# Altium schematic sheet MiniClock.SchDoc
size A4; PageSetup: Record=PageOptions|CenterHorizontal=True|CenterVertical=True|PrintScale=1.05|XCorrection=1.00|YCorrection=1.00|PrintKind=1|BorderSize=5000000|LeftOffset=0|BottomOffset=0|Orientation=2|PaperLength=1000|PaperWidth=1000|Scale=100|PaperSource=7|PrintQuality=-3|MediaType=1|DitherType=10|PrintScaleMode=1|PaperKind=A4|PaperIndex=9
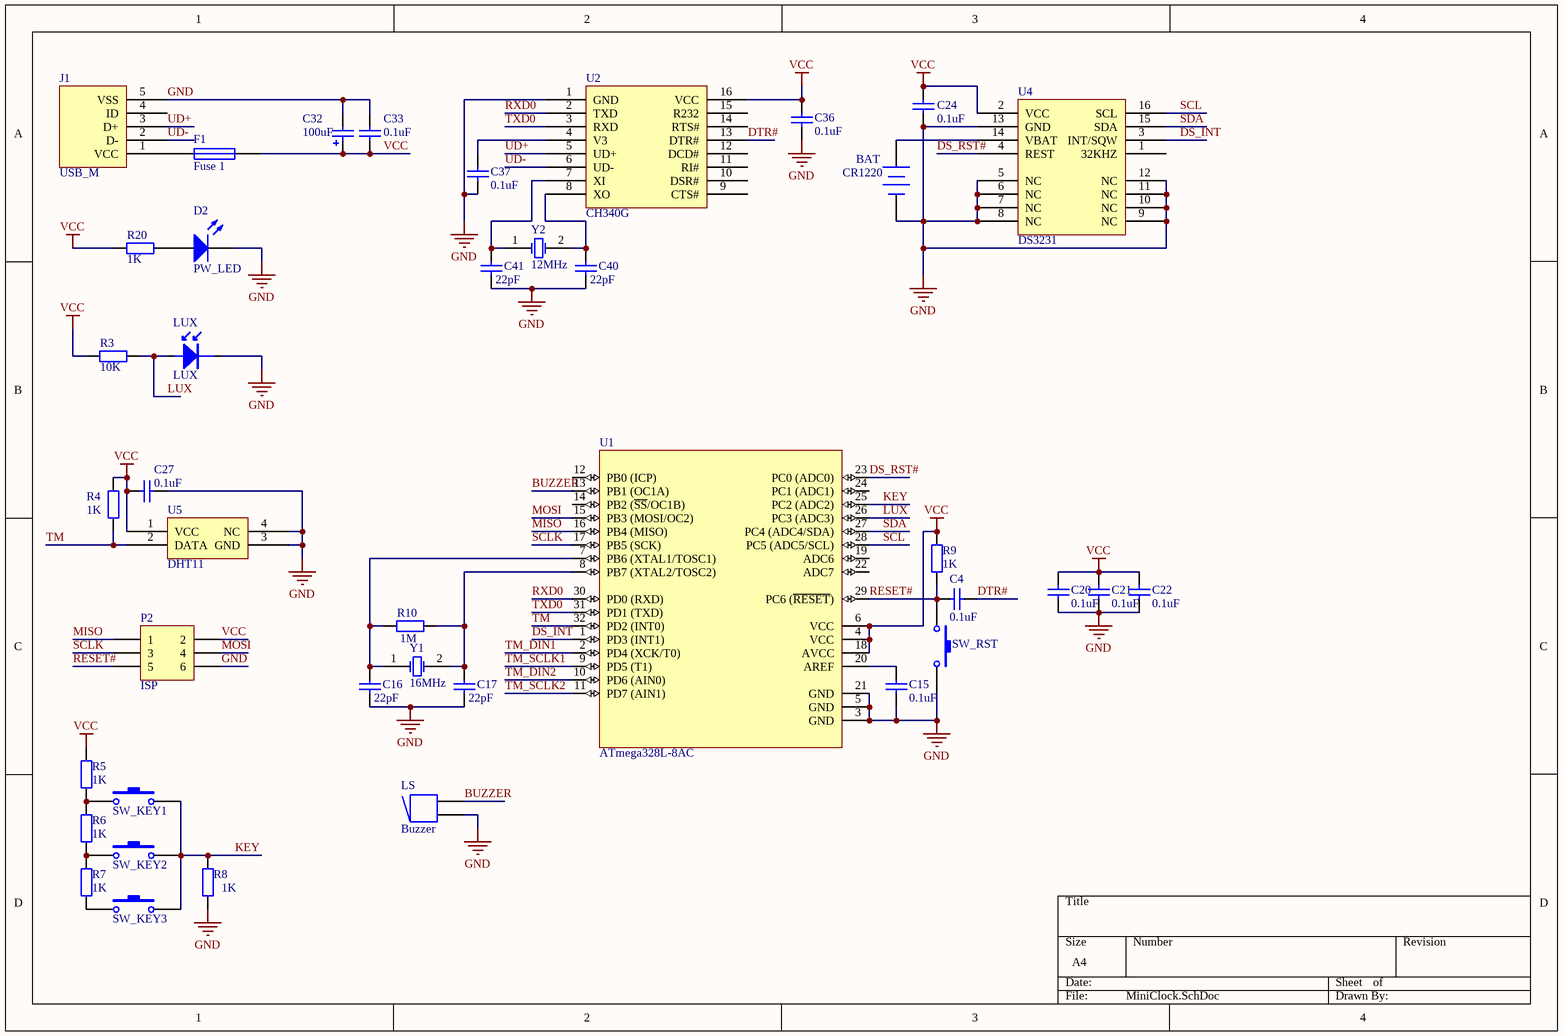
[diagram p0: MiniClock.SchDoc]

## Parts
BAT  CR1220  [CR1220]
C4  value 0.1uF  [C-0805]  (hidden comment: Cap)
C15  value 0.1uF  [C-0805]  (hidden comment: Cap)
C16  value 22pF  [C-0805]  (hidden comment: Cap)
C17  value 22pF  [C-0805]  (hidden comment: Cap)
C20  value 0.1uF  [C-0805]  (hidden comment: Cap)
C21  value 0.1uF  [C-0805]  (hidden comment: Cap)
C22  value 0.1uF  [C-0805]  (hidden comment: Cap)
C24  value 0.1uF  [C-0805]  (hidden comment: Cap)
C27  value 0.1uF  [C-0805]  (hidden comment: Cap)
C32  value 100uF  [CAP-3528]  (hidden comment: Cap Pol2)
C33  value 0.1uF  [C-0805]  (hidden comment: Cap)
C36  value 0.1uF  [C-0805]  (hidden comment: Cap)
C37  value 0.1uF  [C-0805]  (hidden comment: Cap)
C40  value 22pF  [C-0805]  (hidden comment: Cap)
C41  value 22pF  [C-0805]  (hidden comment: Cap)
D2  PW_LED  [LED-0805]
F1  Fuse 1  [0805-1]
J1  USB_M  [USB_MICRO_5S_B]
LS  Buzzer  [BEEP-S]
LUX  LUX  [AX_2.54]
P2  ISP  [HDR2X3]
R3  value 10K  [0805-1]  (hidden comment: Res2)
R4  value 1K  [0805-1]  (hidden comment: Res2)
R5  value 1K  [0805-1]  (hidden comment: Res2)
R6  value 1K  [0805-1]  (hidden comment: Res2)
R7  value 1K  [0805-1]  (hidden comment: Res2)
R8  value 1K  [0805-1]  (hidden comment: Res2)
R9  value 1K  [0805-1]  (hidden comment: Res2)
R10  value 1M  [0805-1]  (hidden comment: Res2)
R20  value 1K  [0805-1]  (hidden comment: Res2)
SW_KEY1  SW-PB  [SW_PB2_A1]  (value not drawn)
SW_KEY2  SW-PB  [SW_PB2_A1]  (value not drawn)
SW_KEY3  SW-PB  [SW_PB2_A1]  (value not drawn)
SW_RST  SW-PB  [SW_PB2_A1]  (value not drawn)
U1  ATmega328L-8AC  [32A_M]
U2  CH340G  [SOIC-16]
U4  DS3231  [SOIC-16W]
U5  DHT11  [DHTxx_simple]
Y1  16MHz  [X-SM49]
Y2  12MHz  [X-SM49]

## Nets
GND: BAT.2(-) C15.1 C16.1 C17.1 C20.1 C21.1 C22.1 C24.1 C27.1 C32.2 C33.2 C36.1 C37.1 C40.1 C41.1 D2.2(K) J1.5(VSS) LS.1 LUX.2 P2.6 R8.2 SW_RST.2 U1.3(GND) U1.5(GND) U1.21(GND) U2.1(GND) U4.5(NC) U4.6(NC) U4.7(NC) U4.8(NC) U4.9(NC) U4.10(NC) U4.11(NC) U4.12(NC) U4.13(GND) U5.3(GND) U5.4(NC)
VCC: C20.2 C21.2 C22.2 C24.2 C27.2 C32.1 C33.1 C36.2 F1.2 P2.2 R3.2 R4.2 R5.2 R9.2 R20.2 U1.4(VCC) U1.6(VCC) U1.18(AVCC) U2.16(VCC) U4.2(VCC) U5.1(VCC)
BUZZER: LS.2 U1.13(PB1_(OC1A))
DS_INT: U1.1(PD3_(INT1)) U4.3(INT/SQW)
DS_RST#: U1.23(PC0_(ADC0)) U4.4(REST)
DTR#: C4.2 U2.13(DTR#)
KEY: R8.1 SW_KEY1.2 SW_KEY2.2 SW_KEY3.2 U1.25(PC2_(ADC2))
LUX: LUX.1 R3.1 U1.26(PC3_(ADC3))
MISO: P2.1 U1.16(PB4_(MISO))
MOSI: P2.4 U1.15(PB3_(MOSI/OC2))
RESET#: C4.1 P2.5 R9.1 SW_RST.1 U1.29(PC6_(~{RESET}))
RXD0: U1.30(PD0_(RXD)) U2.2(TXD)
SCL: U1.28(PC5_(ADC5/SCL)) U4.16(SCL)
SCLK: P2.3 U1.17(PB5_(SCK))
SDA: U1.27(PC4_(ADC4/SDA)) U4.15(SDA)
TM: R4.1 U1.32(PD2_(INT0)) U5.2(DATA)
TM_DIN1: U1.2(PD4_(XCK/T0))
TM_DIN2: U1.10(PD6_(AIN0))
TM_SCLK1: U1.9(PD5_(T1))
TM_SCLK2: U1.11(PD7_(AIN1))
TXD0: U1.31(PD1_(TXD)) U2.3(RXD)
UD+: J1.3(D+) U2.5(UD+)
UD-: J1.2(D-) U2.6(UD-)
NetBAT_1: BAT.1(+) U4.14(VBAT)
NetC15_2: C15.2 U1.20(AREF)
NetC16_2: C16.2 R10.1 U1.7(PB6_(XTAL1/TOSC1)) Y1.1(OSC1)
NetC17_2: C17.2 R10.2 U1.8(PB7_(XTAL2/TOSC2)) Y1.2(OSC2)
NetC37_2: C37.2 U2.4(V3)
NetC40_2: C40.2 U2.8(XO) Y2.2(OSC2)
NetC41_2: C41.2 U2.7(XI) Y2.1(OSC1)
NetD2_1: D2.1(A) R20.1
NetF1_1: F1.1 J1.1(VCC)
NetR5_1: R5.1 R6.2 SW_KEY1.1
NetR6_1: R6.1 R7.2 SW_KEY2.1
NetR7_1: R7.1 SW_KEY3.1

Not connected (* = marked no-connect by the designer): J1 4(ID); U1 12(PB0_(ICP)) 14(PB2_(~{SS}/OC1B)) 19(ADC6) 22(ADC7) 24(PC1_(ADC1)); U2 9(CTS#) 10(DSR#) 11(RI#) 12(DCD#) 14(RTS#) 15(R232); U4 1(32KHZ)

## Library data of the parts
BAT = Battery: Multicell Battery; Published: 24-Mar-1999; LatestRevisionDate: 17-Jul-2002; LatestRevisionNote: Re-released for DXP Platform.; PackageReference: BAT-2; Publisher: Altium Limited; PackageDescription: Battery; 2 Leads
C4 C15-C17 C20-C22 C24 C27 C33 C36 C37 C40 C41 = Cap: Capacitor; Published: 8-Jun-2000; LatestRevisionDate: 17-Jul-2002; LatestRevisionNote: Re-released for DXP Platform.; PackageReference: RAD-0.3; Publisher: Altium Limited; PackageDescription: Radial Cap, Thru-Hole; 2 Leads; 0.3 in Pin Spacing
C32 = Cap Pol2: Polarized Capacitor (Axial); Published: 8-Jun-2000; LatestRevisionDate: 17-Jul-2002; LatestRevisionNote: Re-released for DXP Platform.; PackageReference: POLAR0.8; Publisher: Altium Limited; PackageDescription: Polarized Capacitor; 2 Leads
D2 = LED2: Typical RED, GREEN, YELLOW, AMBER GaAs LED; Published: 8-Jun-2000; LatestRevisionDate: 17-Jul-2002; LatestRevisionNote: Re-released for DXP Platform.; PackageVersion: Feb-2002; PackageReference: 3.2X1.6X1.1; Publisher: Altium Limited; PackageDescription: SM LED; 2 Flat Leads
F1 = Fuse 1: Fuse; Published: 8-Jun-2000; LatestRevisionDate: 17-Jul-2002; LatestRevisionNote: Re-released for DXP Platform.; PackageReference: PIN-W2/E2.8; Publisher: Altium Limited; PackageDescription: Thru-Hole; 2 Leads
J1 = USB_M: Micro/Mini USB
LS = Buzzer: Magnetic Transducer Buzzer; Published: 24-Mar-1999; LatestRevisionDate: 17-Dec-2003; LatestRevisionNote: Schematic revised, PCB Footprint replaced.; DatasheetVersion: 17-Dec-2003; PackageReference: ABSM-1574; Publisher: Altium Limited; PackageDescription: Magnetic Transducer Buzzer; ComponentLink1Description: Manufacturer Link; ComponentLink1URL: http://www.megastar.com/linecard/buzzmode/index.php
P2 = Header 3X2: Header, 3-Pin, Dual row; LatestRevisionDate: 17-Jul-2002; LatestRevisionNote: Re-released for DXP Platform.; Publisher: Altium Limited
R3-R10 R20 = Res2: Resistor; Published: 8-Jun-2000; LatestRevisionDate: 17-Jul-2002; LatestRevisionNote: Re-released for DXP Platform.; PackageReference: AXIAL-0.4; Publisher: Altium Limited; PackageDescription: Axial Device, Thru-Hole; 2 Leads; 0.4 in Pin Spacing
SW_KEY1-SW_KEY3 SW_RST = SW-PB: Switch; Published: 24-Mar-1999; LatestRevisionDate: 17-Jul-2002; LatestRevisionNote: Re-released for DXP Platform.; PackageReference: SPST-2; Publisher: Altium Limited; PackageDescription: Switch; 2 Leads
U1 = ATmega8L-8AC: 8-Bit AVR Microcontroller with 8K Bytes of In-System Programmable Flash Memory; Published: 17-Sep-2003; LatestRevisionDate: 13-Apr-2006; LatestRevisionNote: IPC-7351 Footprint Added.; DatasheetVersion: 2486H-AVR-09/02; PackageVersion: revB, Oct-2001; PackageReference: 32A; Publisher: Altium Limited; PackageDescription: 32-Pin Thin Quad Flat Pack 0.8 mm Pitch; Code_JEDEC: MS-026-ABA; ComponentLink1Description: Manufacturer Link; ComponentLink1URL: http://www.atmel.com; ComponentLink2Description: Datasheet; ComponentLink2URL: http://www.atmel.com/dyn/resources/prod_documents/doc2486.pdf
U5 = DHT22
Y1 Y2 = XTAL: Crystal Oscillator; Published: 8-Jun-2000; LatestRevisionDate: 17-Jul-2002; LatestRevisionNote: Re-released for DXP Platform.; PackageReference: R38; Publisher: Altium Limited; PackageDescription: Crystal, Thru-Hole; 2 Leads; Body 3.1 x 8.2 mm (Dia.xH)